# EasyEDA schematic SCH_SPEAR.json
TITLE: SPEAR; REV: 1.0; Date: 2022-12-17; Sheet: 1/1; Drawn By: Mirco H.; Company: None
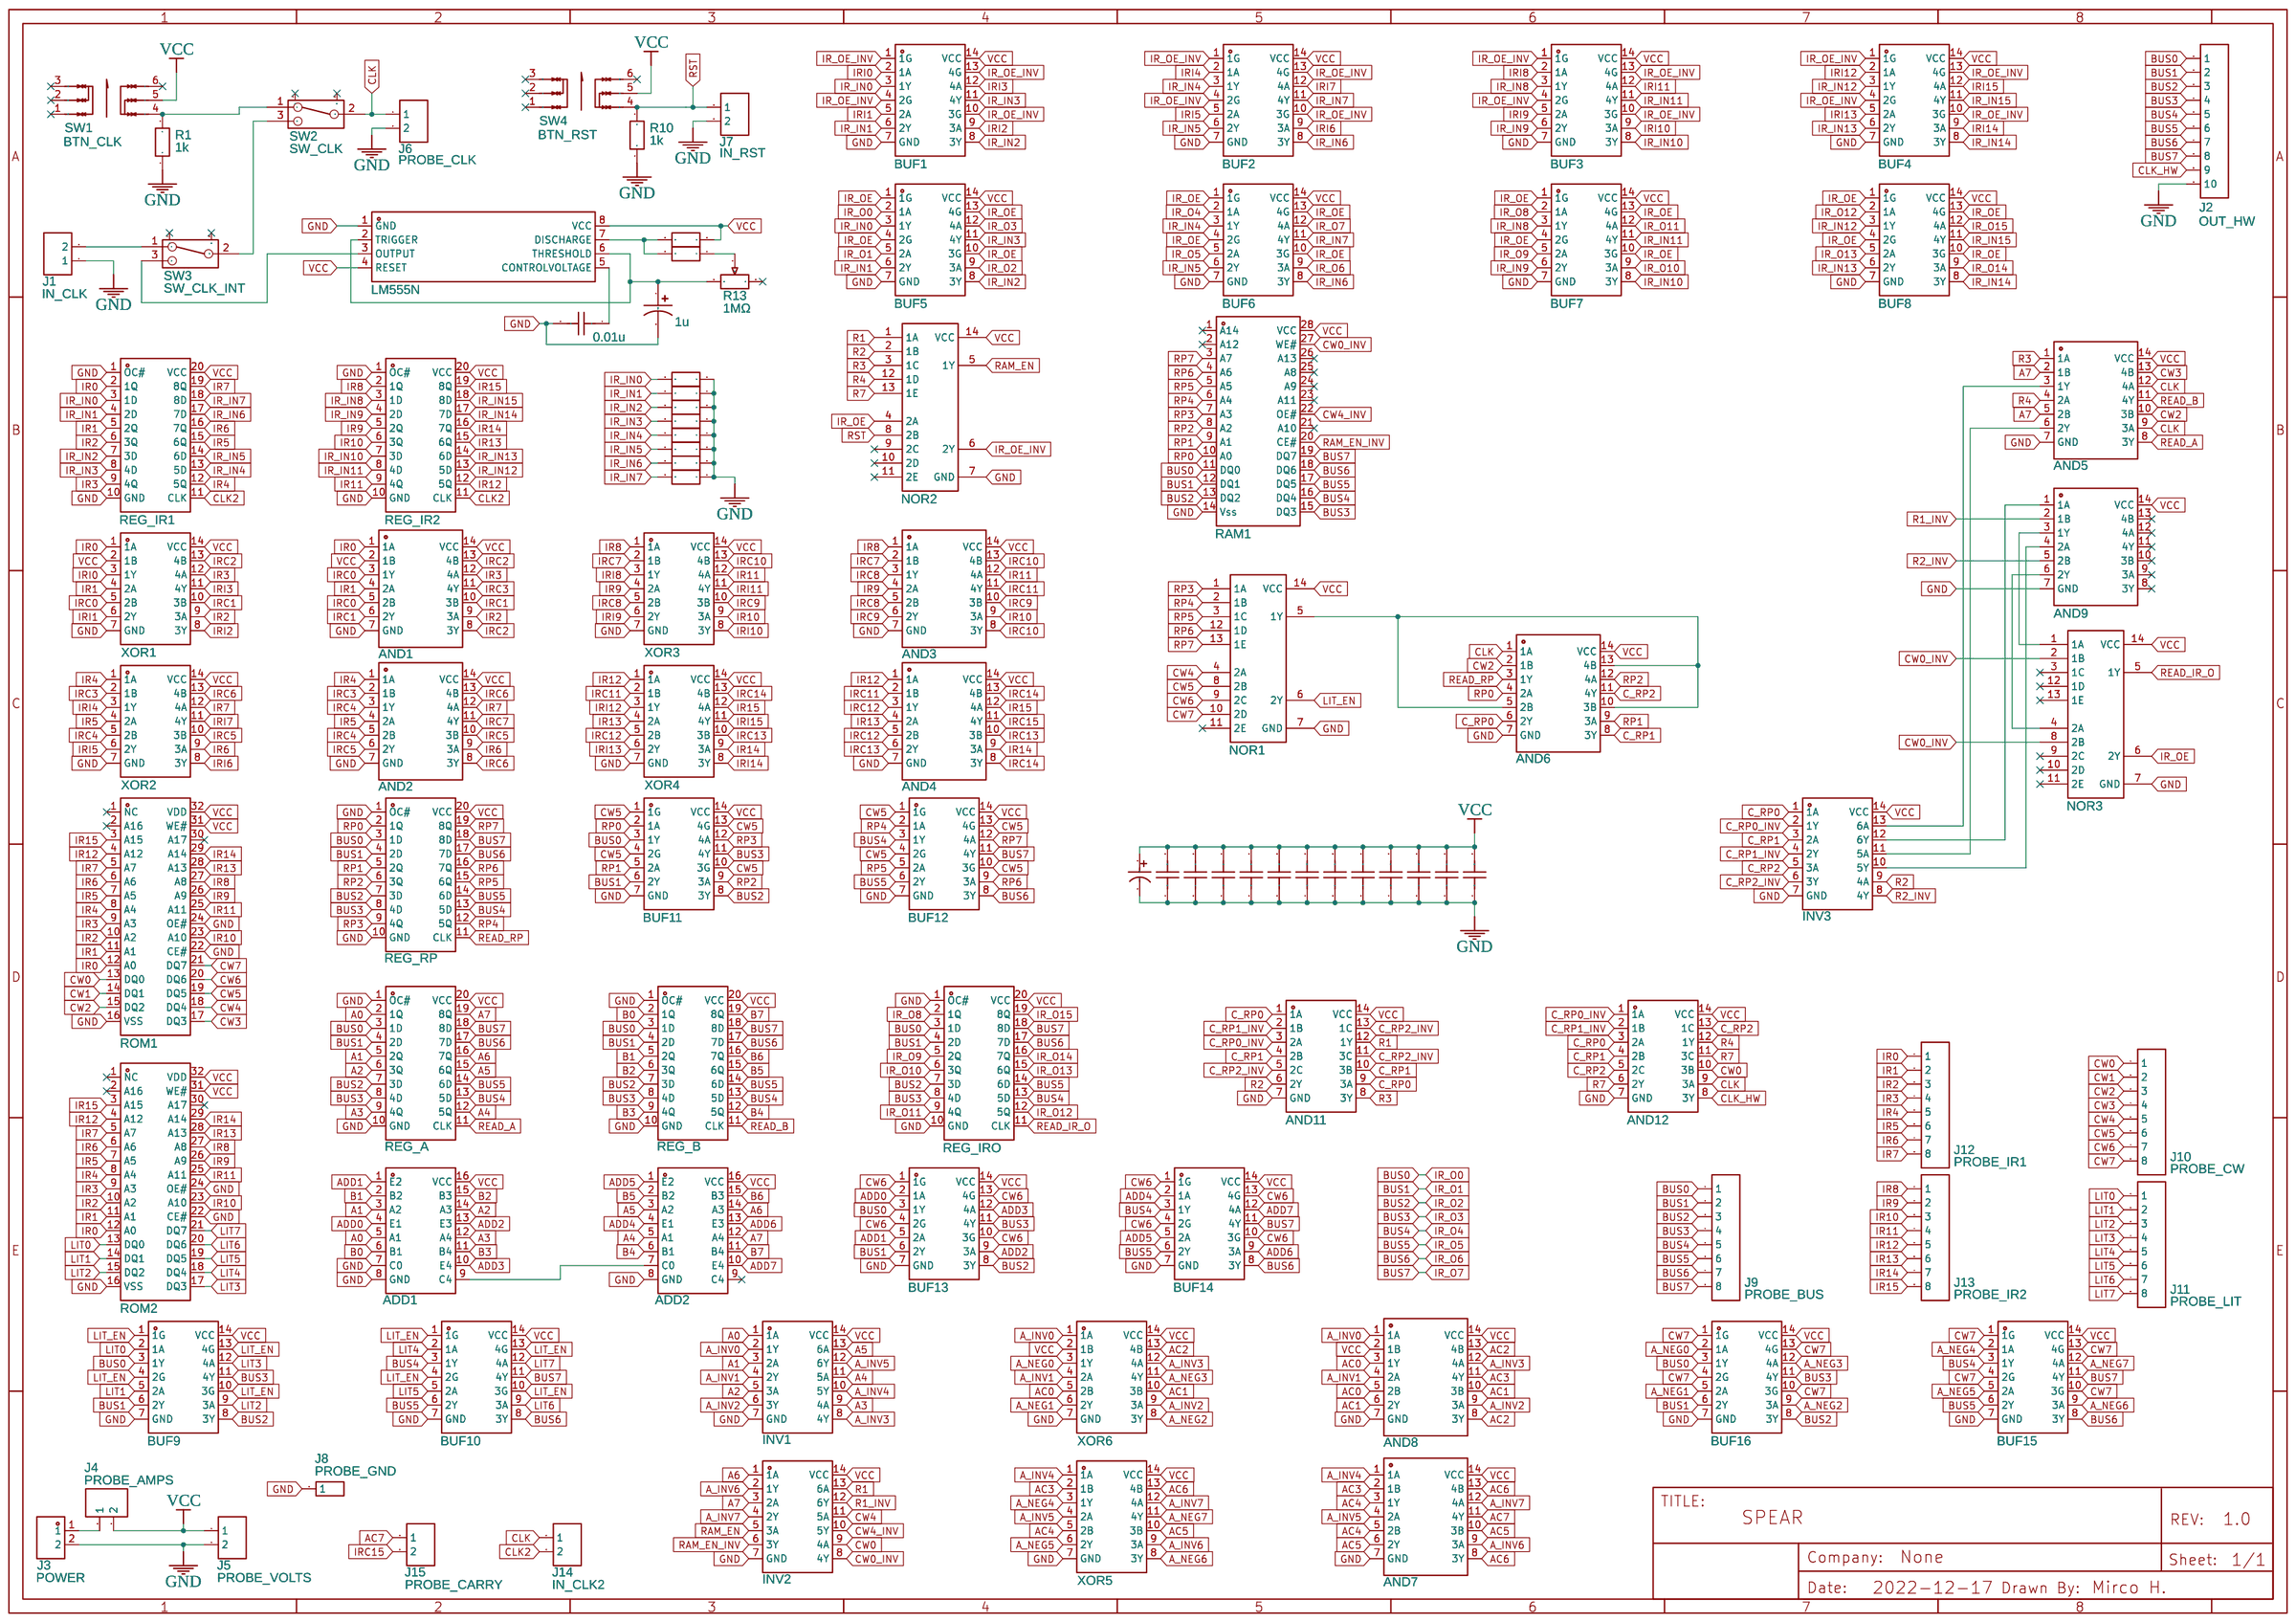
[diagram p0: schematic sheet]

## Parts
ADD1  XD74LS283  [DIP-16_L19.8-W6.5-P2.54-LS7.6-BL]
ADD2  XD74LS283  [DIP-16_L19.8-W6.5-P2.54-LS7.6-BL]
AND1  SN74LS08DR  [SOIC-14_L8.7-W3.9-P1.27-LS6.0-BL]
AND2  SN74LS08DR  [SOIC-14_L8.7-W3.9-P1.27-LS6.0-BL]
AND3  SN74LS08DR  [SOIC-14_L8.7-W3.9-P1.27-LS6.0-BL]
AND4  SN74LS08DR  [SOIC-14_L8.7-W3.9-P1.27-LS6.0-BL]
AND5  SN74LS08DR  [SOIC-14_L8.7-W3.9-P1.27-LS6.0-BL]
AND6  SN74LS08DR  [SOIC-14_L8.7-W3.9-P1.27-LS6.0-BL]
AND7  SN74LS08DR  [SOIC-14_L8.7-W3.9-P1.27-LS6.0-BL]
AND8  SN74LS08DR  [SOIC-14_L8.7-W3.9-P1.27-LS6.0-BL]
AND9  SN74LS08DR  [SOIC-14_L8.7-W3.9-P1.27-LS6.0-BL]
AND11  XL74LS11  [SOIC-14_L8.7-W3.9-P1.27-LS6.0-BL]
AND12  XL74LS11  [SOIC-14_L8.7-W3.9-P1.27-LS6.0-BL]
BUF1  SN74LS126ADR  [SOIC-14_L8.7-W3.9-P1.27-LS6.0-BL]
BUF2  SN74LS126ADR  [SOIC-14_L8.7-W3.9-P1.27-LS6.0-BL]
BUF3  SN74LS126ADR  [SOIC-14_L8.7-W3.9-P1.27-LS6.0-BL]
BUF4  SN74LS126ADR  [SOIC-14_L8.7-W3.9-P1.27-LS6.0-BL]
BUF5  SN74LS126ADR  [SOIC-14_L8.7-W3.9-P1.27-LS6.0-BL]
BUF6  SN74LS126ADR  [SOIC-14_L8.7-W3.9-P1.27-LS6.0-BL]
BUF7  SN74LS126ADR  [SOIC-14_L8.7-W3.9-P1.27-LS6.0-BL]
BUF8  SN74LS126ADR  [SOIC-14_L8.7-W3.9-P1.27-LS6.0-BL]
BUF9  SN74LS126ADR  [SOIC-14_L8.7-W3.9-P1.27-LS6.0-BL]
BUF10  SN74LS126ADR  [SOIC-14_L8.7-W3.9-P1.27-LS6.0-BL]
BUF11  SN74LS126ADR  [SOIC-14_L8.7-W3.9-P1.27-LS6.0-BL]
BUF12  SN74LS126ADR  [SOIC-14_L8.7-W3.9-P1.27-LS6.0-BL]
BUF13  SN74LS126ADR  [SOIC-14_L8.7-W3.9-P1.27-LS6.0-BL]
BUF14  SN74LS126ADR  [SOIC-14_L8.7-W3.9-P1.27-LS6.0-BL]
BUF15  SN74LS126ADR  [SOIC-14_L8.7-W3.9-P1.27-LS6.0-BL]
BUF16  SN74LS126ADR  [SOIC-14_L8.7-W3.9-P1.27-LS6.0-BL]
C1  0.1u  [C0603]
C2  0.01u  [C0603]
C3  1u  [CASE-A_3216]
C4  0.1u  [C0603]
C5  0.1u  [C0603]
C6  0.1u  [C0603]
C7  0.1u  [C0603]
C8  0.1u  [C0603]
C9  0.1u  [C0603]
C10  0.1u  [C0603]
C11  0.1u  [C0603]
C12  0.1u  [C0603]
C13  0.1u  [C0603]
C14  0.1u  [C0603]
C15  1000uF  [CAP-TH_BD10.0-P5.00-D1.0-FD]
INV1  XL74LS04  [SOP-14_L8.6-W3.9-P1.27-LS6.0-BL]
INV2  XL74LS04  [SOP-14_L8.6-W3.9-P1.27-LS6.0-BL]
INV3  XL74LS04  [SOP-14_L8.6-W3.9-P1.27-LS6.0-BL]
J1  IN_CLK  [HDR-M-2.54_1X2]
J2  OUT_HW  [HDR-M-2.54_1X10]
J3  POWER  [CONN-TH_2P-P5.00_L7.8-W10.0]
J4  PROBE_AMPS  [HDR-M-2.54_1X2]
J5  PROBE_VOLTS  [HDR-M-2.54_1X2]
J6  PROBE_CLK  [HDR-M-2.54_1X2]
J7  IN_RST  [HDR-M-2.54_1X2]
J8  PROBE_GND  [HDR-M-2.54_1X1]
J9  PROBE_BUS  [HDR-M-2.54_1X8]
J10  PROBE_CW  [HDR-M-2.54_1X8]
J11  PROBE_LIT  [HDR-M-2.54_1X8]
J12  PROBE_IR1  [HDR-M-2.54_1X8]
J13  PROBE_IR2  [HDR-M-2.54_1X8]
J14  IN_CLK2  [HDR-M-2.54_1X2]
J15  PROBE_CARRY  [HDR-M-2.54_1X2]
NOR1  LISA_CPU_74LS260  [LISA_DIP_14]
NOR2  LISA_CPU_74LS260  [LISA_DIP_14]
NOR3  LISA_CPU_74LS260  [LISA_DIP_14]
R1  1k  [R0603]
R2  10k  [R0603]
R3  10k  [R0603]
R4  10k  [R0603]
R5  10k  [R0603]
R6  10k  [R0603]
R7  10k  [R0603]
R8  10k  [R0603]
R9  10k  [R0603]
R10  1k  [R0603]
R11  1k  [R0603]
R12  1k  [R0603]
R13  1MΩ  [RES-ADJ-TH_3P-L7.1-W6.9-P2.50-L_3362P]
RAM1  LY62256SL-70LL  [PDIP-28_L37.0-W13.5-P2.54-LS15.6-BL]
REG1  REG_IR1  [SOIC-20_L13.3-W5.5-P1.27-LS7.8-BL]
REG2  REG_IR2  [SOIC-20_L13.3-W5.5-P1.27-LS7.8-BL]
REG_A  SN74LS374NSR  [SOIC-20_L13.3-W5.5-P1.27-LS7.8-BL]
REG_B  SN74LS374NSR  [SOIC-20_L13.3-W5.5-P1.27-LS7.8-BL]
REG_IRO  SN74LS374NSR  [SOIC-20_L13.3-W5.5-P1.27-LS7.8-BL]
REG_RP  SN74LS374NSR  [SOIC-20_L13.3-W5.5-P1.27-LS7.8-BL]
ROM1  SST39SF020A-70-4I-NHE  [PDIP-32_L41.7-W13.3-P2.54-LS15.2-BL]
ROM2  SST39SF020A-70-4I-NHE  [PDIP-32_L41.7-W13.3-P2.54-LS15.2-BL]
SW1  BTN_CLK  [SW-TH_6P-L8.0-W8.0-P2.50]
SW2  SW_CLK  [SW-TH_SK-12E12-G5]
SW3  SW_CLK_INT  [SW-TH_SK-12E12-G5]
SW4  BTN_RST  [SW-TH_6P-L8.0-W8.0-P2.50]
U1  LM555N  [DIP-8_L9.7-W6.4-P2.54-LS7.6-BL]
XOR1  XD74LS86  [DIP-14_L20.0-W7.6-P2.54-LS7.6-BL]
XOR2  XD74LS86  [DIP-14_L20.0-W7.6-P2.54-LS7.6-BL]
XOR3  XD74LS86  [DIP-14_L20.0-W7.6-P2.54-LS7.6-BL]
XOR4  XD74LS86  [DIP-14_L20.0-W7.6-P2.54-LS7.6-BL]
XOR5  XD74LS86  [DIP-14_L20.0-W7.6-P2.54-LS7.6-BL]
XOR6  XD74LS86  [DIP-14_L20.0-W7.6-P2.54-LS7.6-BL]

## Library data of the parts
ADD1 ADD2 = XD74LS283: Supplier: LCSC; Supplier Part: C561301; Manufacturer: XINLUDA(信路达); Contributor: LCSC; JLCPCB Part Class: Extended Part
AND1-AND9 = SN74LS08DR: Supplier: LCSC; Manufacturer: TI(德州仪器); Supplier Part: C6802; JLCPCB Part Class: Extended Part
AND11 AND12 = XL74LS11: Supplier: LCSC; Supplier Part: C521168; Manufacturer: XINLUDA(信路达); Contributor: LCSC; JLCPCB Part Class: Extended Part
BUF1-BUF16 = SN74LS126ADR: Supplier: LCSC; Supplier Part: C2865257; Manufacturer: TI(德州仪器); link: https://atta.szlcsc.comnull; Contributor: LCSC
C1 C2 C4-C14 = C_0603_US: Contributor: LCEDA_Lib
C3 = C_Tan_SMD_A_US: Contributor: LCEDA_Lib
C15 = 1000uF 25V: Supplier: LCSC; Manufacturer: CX(承兴); Manufacturer Part: KM108M025G17RR0VH2FP0; Supplier Part: C10750; JLCPCB Part Class: Extended Part
INV1-INV3 = XL74LS04: Supplier: LCSC; Supplier Part: C513511; Manufacturer: XINLUDA(信路达); Contributor: LCSC; JLCPCB Part Class: Extended Part
J1 J4-J7 J14 J15 = HDR-M-2.54_1x2: Supplier Part: C124375; Supplier: LCSC; Contributor: LCEDA_Lib
J2 = HDR-M-2.54_1x10: Supplier Part: C57369; Supplier: LCSC; Contributor: LCEDA_Lib
J3 = DB126V-5.0-2P: Supplier: LCSC; Supplier Part: C395849; Manufacturer: DIBO(地博电气); Manufacturer Part: DB126V-5.0-2P-GN-P; Contributor: LCSC; JLCPCB Part Class: Extended Part
J8 = HDR-M-2.54_1x1: Supplier Part: C81276; Supplier: LCSC; Contributor: LCEDA_Lib
J9-J13 = HDR-M-2.54_1x8: Supplier Part: C190820; Supplier: LCSC; Contributor: LCEDA_Lib
NOR1-NOR3 = LISA_CPU_74LS260: Contributor: William Tooker
R1-R12 = R_0603_EU: Contributor: LCEDA_Lib
R13 = 3362P-1-105_C118945: Supplier: LCSC; Supplier Part: C118945; Manufacturer: BOCHEN(博晨); Manufacturer Part: 3362P-1-105; Resistance(Ohms): 1M; Contributor: LCSC; Resistance (Ohms): 1M; JLCPCB Part Class: Extended Part
RAM1 = LY62256SL-70LL: Supplier: LCSC; Supplier Part: C261867; Manufacturer: Lyontek Inc.; Contributor: LCSC
REG1 REG2 REG_A REG_B REG_IRO REG_RP = SN74LS374NSR: Supplier: LCSC; Manufacturer: TI(德州仪器); Supplier Part: C7764; JLCPCB Part Class: Extended Part
ROM1 ROM2 = SST39SF020A-70-4I-NHE: Supplier: LCSC; Supplier Part: C645934; Manufacturer: MICROCHIP(美国微芯); link: https://atta.szlcsc.comnull; Contributor: lcsc; JLCPCB Part Class: Extended Part
SW1 SW4 = XKB8080-W: Supplier: LCSC; Supplier Part: C318861; Manufacturer: XKB Enterprise; Contributor: LCSC; JLCPCB Part Class: Extended Part
SW2 SW3 = SK-12E12-G5: Supplier: LCSC; Supplier Part: C136720; Manufacturer: 韩国韩荣; Contributor: LCSC; JLCPCB Part Class: Extended Part
U1 = LM555N: Supplier: LCSC; Supplier Part: C725327; Manufacturer: HGSEMI(华冠); Contributor: LCSC; JLCPCB Part Class: Extended Part
XOR1-XOR6 = XD74LS86: Supplier: LCSC; Supplier Part: C556290; Manufacturer: XINLUDA; Contributor: LCSC; JLCPCB Part Class: Extended Part

## Nets
GND: ADD1.7(C0) ADD1.8(GND) ADD2.8(GND) AND1.7(GND) AND2.7(GND) AND3.7(GND) AND4.7(GND) AND5.7(GND) AND6.7(GND) AND7.7(GND) AND8.7(GND) AND9.7(GND) AND11.7(GND) AND12.7(GND) BUF1.7(GND) BUF2.7(GND) BUF3.7(GND) BUF4.7(GND) BUF5.7(GND) BUF6.7(GND) BUF7.7(GND) BUF8.7(GND) BUF9.7(GND) BUF10.7(GND) BUF11.7(GND) BUF12.7(GND) BUF13.7(GND) BUF14.7(GND) BUF15.7(GND) BUF16.7(GND) C1.1 C2.2 C3.2 C4.1 C5.1 C6.1 C7.1 C8.1 C9.1 C10.1 C11.1 C12.1 C13.1 C14.1 C15.2 INV1.7(GND) INV2.7(GND) INV3.7(GND) J1.1 J2.10 J3.2 J5.2 J6.2 J7.2 J8.1 NOR1.7(GND) NOR2.7(GND) NOR3.7(GND) R1.1 R2.1 R3.1 R4.1 R5.1 R6.1 R7.1 R8.1 R9.1 R10.1 RAM1.14(Vss) REG1.1(OC#) REG1.10(GND) REG2.1(OC#) REG2.10(GND) REG_A.1(OC#) REG_A.10(GND) REG_B.1(OC#) REG_B.10(GND) REG_IRO.1(OC#) REG_IRO.10(GND) REG_RP.1(OC#) REG_RP.10(GND) ROM1.16(VSS) ROM1.22(CE#) ROM1.24(OE#) ROM2.16(VSS) ROM2.22(CE#) ROM2.24(OE#) U1.1(GND) XOR1.7(GND) XOR2.7(GND) XOR3.7(GND) XOR4.7(GND) XOR5.7(GND) XOR6.7(GND)
VCC: ADD1.16(VCC) ADD2.16(VCC) AND1.2(1B) AND1.14(VCC) AND2.14(VCC) AND3.14(VCC) AND4.14(VCC) AND5.14(VCC) AND6.14(VCC) AND7.14(VCC) AND8.2(1B) AND8.14(VCC) AND9.14(VCC) AND11.14(VCC) AND12.14(VCC) BUF1.14(VCC) BUF2.14(VCC) BUF3.14(VCC) BUF4.14(VCC) BUF5.14(VCC) BUF6.14(VCC) BUF7.14(VCC) BUF8.14(VCC) BUF9.14(VCC) BUF10.14(VCC) BUF11.14(VCC) BUF12.14(VCC) BUF13.14(VCC) BUF14.14(VCC) BUF15.14(VCC) BUF16.14(VCC) C1.2 C4.2 C5.2 C6.2 C7.2 C8.2 C9.2 C10.2 C11.2 C12.2 C13.2 C14.2 C15.1 INV1.14(VCC) INV2.14(VCC) INV3.14(VCC) J4.2 J5.1 NOR1.14(VCC) NOR2.14(VCC) NOR3.14(VCC) R11.1 RAM1.28(VCC) REG1.20(VCC) REG2.20(VCC) REG_A.20(VCC) REG_B.20(VCC) REG_IRO.20(VCC) REG_RP.20(VCC) ROM1.31(WE#) ROM1.32(VDD) ROM2.31(WE#) ROM2.32(VDD) SW1.5 SW4.5 U1.4(RESET) U1.8(VCC) XOR1.2(1B) XOR1.14(VCC) XOR2.14(VCC) XOR3.14(VCC) XOR4.14(VCC) XOR5.14(VCC) XOR6.2(1B) XOR6.14(VCC)
A0: ADD1.5(A1) INV1.1(1A) REG_A.2(1Q)
A1: ADD1.3(A2) INV1.3(2A) REG_A.5(2Q)
A2: ADD1.14(A3) INV1.5(3A) REG_A.6(3Q)
A3: ADD1.12(A4) INV1.9(4A) REG_A.9(4Q)
A4: ADD2.5(A1) INV1.11(5A) REG_A.12(5Q)
A5: ADD2.3(A2) INV1.13(6A) REG_A.15(6Q)
A6: ADD2.14(A3) INV2.1(1A) REG_A.16(7Q)
A7: ADD2.12(A4) AND5.2(1B) AND5.5(2B) INV2.3(2A) REG_A.19(8Q)
A_INV0: AND8.1(1A) INV1.2(1Y) XOR6.1(1A)
A_INV1: AND8.4(2A) INV1.4(2Y) XOR6.4(2A)
A_INV2: AND8.9(3A) INV1.6(3Y) XOR6.9(3A)
A_INV3: AND8.12(4A) INV1.8(4Y) XOR6.12(4A)
A_INV4: AND7.1(1A) INV1.10(5Y) XOR5.1(1A)
A_INV5: AND7.4(2A) INV1.12(6Y) XOR5.4(2A)
A_INV6: AND7.9(3A) INV2.2(1Y) XOR5.9(3A)
A_INV7: AND7.12(4A) INV2.4(2Y) XOR5.12(4A)
A_NEG0: BUF16.2(1A) XOR6.3(1Y)
A_NEG1: BUF16.5(2A) XOR6.6(2Y)
A_NEG2: BUF16.9(3A) XOR6.8(3Y)
A_NEG3: BUF16.12(4A) XOR6.11(4Y)
A_NEG4: BUF15.2(1A) XOR5.3(1Y)
A_NEG5: BUF15.5(2A) XOR5.6(2Y)
A_NEG6: BUF15.9(3A) XOR5.8(3Y)
A_NEG7: BUF15.12(4A) XOR5.11(4Y)
AC0: AND8.3(1Y) AND8.5(2B) XOR6.5(2B)
AC1: AND8.6(2Y) AND8.10(3B) XOR6.10(3B)
AC2: AND8.8(3Y) AND8.13(4B) XOR6.13(4B)
AC3: AND7.2(1B) AND8.11(4Y) XOR5.2(1B)
AC4: AND7.3(1Y) AND7.5(2B) XOR5.5(2B)
AC5: AND7.6(2Y) AND7.10(3B) XOR5.10(3B)
AC6: AND7.8(3Y) AND7.13(4B) XOR5.13(4B)
AC7: AND7.11(4Y) J15.1
ADD0: ADD1.4(E1) BUF13.2(1A)
ADD1: ADD1.1(E2) BUF13.5(2A)
ADD2: ADD1.13(E3) BUF13.9(3A)
ADD3: ADD1.10(E4) BUF13.12(4A)
ADD4: ADD2.4(E1) BUF14.2(1A)
ADD5: ADD2.1(E2) BUF14.5(2A)
ADD6: ADD2.13(E3) BUF14.9(3A)
ADD7: ADD2.10(E4) BUF14.12(4A)
B0: ADD1.6(B1) REG_B.2(1Q)
B1: ADD1.2(B2) REG_B.5(2Q)
B2: ADD1.15(B3) REG_B.6(3Q)
B3: ADD1.11(B4) REG_B.9(4Q)
B4: ADD2.6(B1) REG_B.12(5Q)
B5: ADD2.2(B2) REG_B.15(6Q)
B6: ADD2.15(B3) REG_B.16(7Q)
B7: ADD2.11(B4) REG_B.19(8Q)
BUS0: BUF5.2(1A) BUF9.3(1Y) BUF11.3(1Y) BUF13.3(1Y) BUF16.3(1Y) J2.1 J9.1 RAM1.11(DQ0) REG_A.3(1D) REG_B.3(1D) REG_IRO.3(1D) REG_RP.3(1D)
BUS1: BUF5.5(2A) BUF9.6(2Y) BUF11.6(2Y) BUF13.6(2Y) BUF16.6(2Y) J2.2 J9.2 RAM1.12(DQ1) REG_A.4(2D) REG_B.4(2D) REG_IRO.4(2D) REG_RP.4(2D)
BUS2: BUF5.9(3A) BUF9.8(3Y) BUF11.8(3Y) BUF13.8(3Y) BUF16.8(3Y) J2.3 J9.3 RAM1.13(DQ2) REG_A.7(3D) REG_B.7(3D) REG_IRO.7(3D) REG_RP.7(3D)
BUS3: BUF5.12(4A) BUF9.11(4Y) BUF11.11(4Y) BUF13.11(4Y) BUF16.11(4Y) J2.4 J9.4 RAM1.15(DQ3) REG_A.8(4D) REG_B.8(4D) REG_IRO.8(4D) REG_RP.8(4D)
BUS4: BUF6.2(1A) BUF10.3(1Y) BUF12.3(1Y) BUF14.3(1Y) BUF15.3(1Y) J2.5 J9.5 RAM1.16(DQ4) REG_A.13(5D) REG_B.13(5D) REG_IRO.13(5D) REG_RP.13(5D)
BUS5: BUF6.5(2A) BUF10.6(2Y) BUF12.6(2Y) BUF14.6(2Y) BUF15.6(2Y) J2.6 J9.6 RAM1.17(DQ5) REG_A.14(6D) REG_B.14(6D) REG_IRO.14(6D) REG_RP.14(6D)
BUS6: BUF6.9(3A) BUF10.8(3Y) BUF12.8(3Y) BUF14.8(3Y) BUF15.8(3Y) J2.7 J9.7 RAM1.18(DQ6) REG_A.17(7D) REG_B.17(7D) REG_IRO.17(7D) REG_RP.17(7D)
BUS7: BUF6.12(4A) BUF10.11(4Y) BUF12.11(4Y) BUF14.11(4Y) BUF15.11(4Y) J2.8 J9.8 RAM1.19(DQ7) REG_A.18(8D) REG_B.18(8D) REG_IRO.18(8D) REG_RP.18(8D)
C_RP0: AND6.6(2Y) AND11.1(1A) AND11.9(3A) AND12.3(2A) INV3.1(1A)
C_RP0_INV: AND11.3(2A) AND12.1(1A) INV3.2(1Y)
C_RP1: AND6.8(3Y) AND11.4(2B) AND11.10(3B) AND12.4(2B) INV3.3(2A)
C_RP1_INV: AND11.2(1B) AND12.2(1B) INV3.4(2Y)
C_RP2: AND6.11(4Y) AND12.5(2C) AND12.13(1C) INV3.5(3A)
C_RP2_INV: AND11.5(2C) AND11.11(3C) AND11.13(1C) INV3.6(3Y)
CLK: AND5.9(3A) AND5.12(4A) AND6.1(1A) AND12.9(3A) J6.1 J14.1 SW2.2
CLK2: J14.2 REG1.11(CLK) REG2.11(CLK)
CLK_HW: AND12.8(3Y) J2.9
CW0: AND12.10(3B) INV2.9(4A) J10.1 ROM1.13(DQ0)
CW0_INV: INV2.8(4Y) NOR3.2(1B) NOR3.8(2B) RAM1.27(WE#)
CW1: J10.2 ROM1.14(DQ1)
CW2: AND5.10(3B) AND6.2(1B) J10.3 ROM1.15(DQ2)
CW3: AND5.13(4B) J10.4 ROM1.17(DQ3)
CW4: INV2.11(5A) J10.5 NOR1.4(2A) ROM1.18(DQ4)
CW4_INV: INV2.10(5Y) RAM1.22(OE#)
CW5: BUF11.1(1G) BUF11.4(2G) BUF11.10(3G) BUF11.13(4G) BUF12.1(1G) BUF12.4(2G) BUF12.10(3G) BUF12.13(4G) J10.6 NOR1.8(2B) ROM1.19(DQ5)
CW6: BUF13.1(1G) BUF13.4(2G) BUF13.10(3G) BUF13.13(4G) BUF14.1(1G) BUF14.4(2G) BUF14.10(3G) BUF14.13(4G) J10.7 NOR1.9(2C) ROM1.20(DQ6)
CW7: BUF15.1(1G) BUF15.4(2G) BUF15.10(3G) BUF15.13(4G) BUF16.1(1G) BUF16.4(2G) BUF16.10(3G) BUF16.13(4G) J10.8 NOR1.10(2D) ROM1.21(DQ7)
IR0: AND1.1(1A) J12.1 REG1.2(1Q) ROM1.12(A0) ROM2.12(A0) XOR1.1(1A)
IR1: AND1.4(2A) J12.2 REG1.5(2Q) ROM1.11(A1) ROM2.11(A1) XOR1.4(2A)
IR2: AND1.9(3A) J12.3 REG1.6(3Q) ROM1.10(A2) ROM2.10(A2) XOR1.9(3A)
IR3: AND1.12(4A) J12.4 REG1.9(4Q) ROM1.9(A3) ROM2.9(A3) XOR1.12(4A)
IR4: AND2.1(1A) J12.5 REG1.12(5Q) ROM1.8(A4) ROM2.8(A4) XOR2.1(1A)
IR5: AND2.4(2A) J12.6 REG1.15(6Q) ROM1.7(A5) ROM2.7(A5) XOR2.4(2A)
IR6: AND2.9(3A) J12.7 REG1.16(7Q) ROM1.6(A6) ROM2.6(A6) XOR2.9(3A)
IR7: AND2.12(4A) J12.8 REG1.19(8Q) ROM1.5(A7) ROM2.5(A7) XOR2.12(4A)
IR8: AND3.1(1A) J13.1 REG2.2(1Q) ROM1.27(A8) ROM2.27(A8) XOR3.1(1A)
IR9: AND3.4(2A) J13.2 REG2.5(2Q) ROM1.26(A9) ROM2.26(A9) XOR3.4(2A)
IR10: AND3.9(3A) J13.3 REG2.6(3Q) ROM1.23(A10) ROM2.23(A10) XOR3.9(3A)
IR11: AND3.12(4A) J13.4 REG2.9(4Q) ROM1.25(A11) ROM2.25(A11) XOR3.12(4A)
IR12: AND4.1(1A) J13.5 REG2.12(5Q) ROM1.4(A12) ROM2.4(A12) XOR4.1(1A)
IR13: AND4.4(2A) J13.6 REG2.15(6Q) ROM1.28(A13) ROM2.28(A13) XOR4.4(2A)
IR14: AND4.9(3A) J13.7 REG2.16(7Q) ROM1.29(A14) ROM2.29(A14) XOR4.9(3A)
IR15: AND4.12(4A) J13.8 REG2.19(8Q) ROM1.3(A15) ROM2.3(A15) XOR4.12(4A)
IR_IN0: BUF1.3(1Y) BUF5.3(1Y) R2.2 REG1.3(1D)
IR_IN1: BUF1.6(2Y) BUF5.6(2Y) R3.2 REG1.4(2D)
IR_IN2: BUF1.8(3Y) BUF5.8(3Y) R4.2 REG1.7(3D)
IR_IN3: BUF1.11(4Y) BUF5.11(4Y) R5.2 REG1.8(4D)
IR_IN4: BUF2.3(1Y) BUF6.3(1Y) R6.2 REG1.13(5D)
IR_IN5: BUF2.6(2Y) BUF6.6(2Y) R7.2 REG1.14(6D)
IR_IN6: BUF2.8(3Y) BUF6.8(3Y) R8.2 REG1.17(7D)
IR_IN7: BUF2.11(4Y) BUF6.11(4Y) R9.2 REG1.18(8D)
IR_IN8: BUF3.3(1Y) BUF7.3(1Y) REG2.3(1D)
IR_IN9: BUF3.6(2Y) BUF7.6(2Y) REG2.4(2D)
IR_IN10: BUF3.8(3Y) BUF7.8(3Y) REG2.7(3D)
IR_IN11: BUF3.11(4Y) BUF7.11(4Y) REG2.8(4D)
IR_IN12: BUF4.3(1Y) BUF8.3(1Y) REG2.13(5D)
IR_IN13: BUF4.6(2Y) BUF8.6(2Y) REG2.14(6D)
IR_IN14: BUF4.8(3Y) BUF8.8(3Y) REG2.17(7D)
IR_IN15: BUF4.11(4Y) BUF8.11(4Y) REG2.18(8D)
IR_O8: BUF7.2(1A) REG_IRO.2(1Q)
IR_O9: BUF7.5(2A) REG_IRO.5(2Q)
IR_O10: BUF7.9(3A) REG_IRO.6(3Q)
IR_O11: BUF7.12(4A) REG_IRO.9(4Q)
IR_O12: BUF8.2(1A) REG_IRO.12(5Q)
IR_O13: BUF8.5(2A) REG_IRO.15(6Q)
IR_O14: BUF8.9(3A) REG_IRO.16(7Q)
IR_O15: BUF8.12(4A) REG_IRO.19(8Q)
IR_OE: BUF5.1(1G) BUF5.4(2G) BUF5.10(3G) BUF5.13(4G) BUF6.1(1G) BUF6.4(2G) BUF6.10(3G) BUF6.13(4G) BUF7.1(1G) BUF7.4(2G) BUF7.10(3G) BUF7.13(4G) BUF8.1(1G) BUF8.4(2G) BUF8.10(3G) BUF8.13(4G) NOR2.4(2A) NOR3.6(2Y)
IR_OE_INV: BUF1.1(1G) BUF1.4(2G) BUF1.10(3G) BUF1.13(4G) BUF2.1(1G) BUF2.4(2G) BUF2.10(3G) BUF2.13(4G) BUF3.1(1G) BUF3.4(2G) BUF3.10(3G) BUF3.13(4G) BUF4.1(1G) BUF4.4(2G) BUF4.10(3G) BUF4.13(4G) NOR2.6(2Y)
IRC0: AND1.3(1Y) AND1.5(2B) XOR1.5(2B)
IRC1: AND1.6(2Y) AND1.10(3B) XOR1.10(3B)
IRC2: AND1.8(3Y) AND1.13(4B) XOR1.13(4B)
IRC3: AND1.11(4Y) AND2.2(1B) XOR2.2(1B)
IRC4: AND2.3(1Y) AND2.5(2B) XOR2.5(2B)
IRC5: AND2.6(2Y) AND2.10(3B) XOR2.10(3B)
IRC6: AND2.8(3Y) AND2.13(4B) XOR2.13(4B)
IRC7: AND2.11(4Y) AND3.2(1B) XOR3.2(1B)
IRC8: AND3.3(1Y) AND3.5(2B) XOR3.5(2B)
IRC9: AND3.6(2Y) AND3.10(3B) XOR3.10(3B)
IRC10: AND3.8(3Y) AND3.13(4B) XOR3.13(4B)
IRC11: AND3.11(4Y) AND4.2(1B) XOR4.2(1B)
IRC12: AND4.3(1Y) AND4.5(2B) XOR4.5(2B)
IRC13: AND4.6(2Y) AND4.10(3B) XOR4.10(3B)
IRC14: AND4.8(3Y) AND4.13(4B) XOR4.13(4B)
IRC15: AND4.11(4Y) J15.2
IRI0: BUF1.2(1A) XOR1.3(1Y)
IRI1: BUF1.5(2A) XOR1.6(2Y)
IRI2: BUF1.9(3A) XOR1.8(3Y)
IRI3: BUF1.12(4A) XOR1.11(4Y)
IRI4: BUF2.2(1A) XOR2.3(1Y)
IRI5: BUF2.5(2A) XOR2.6(2Y)
IRI6: BUF2.9(3A) XOR2.8(3Y)
IRI7: BUF2.12(4A) XOR2.11(4Y)
IRI8: BUF3.2(1A) XOR3.3(1Y)
IRI9: BUF3.5(2A) XOR3.6(2Y)
IRI10: BUF3.9(3A) XOR3.8(3Y)
IRI11: BUF3.12(4A) XOR3.11(4Y)
IRI12: BUF4.2(1A) XOR4.3(1Y)
IRI13: BUF4.5(2A) XOR4.6(2Y)
IRI14: BUF4.9(3A) XOR4.8(3Y)
IRI15: BUF4.12(4A) XOR4.11(4Y)
LIT0: BUF9.2(1A) J11.1 ROM2.13(DQ0)
LIT1: BUF9.5(2A) J11.2 ROM2.14(DQ1)
LIT2: BUF9.9(3A) J11.3 ROM2.15(DQ2)
LIT3: BUF9.12(4A) J11.4 ROM2.17(DQ3)
LIT4: BUF10.2(1A) J11.5 ROM2.18(DQ4)
LIT5: BUF10.5(2A) J11.6 ROM2.19(DQ5)
LIT6: BUF10.9(3A) J11.7 ROM2.20(DQ6)
LIT7: BUF10.12(4A) J11.8 ROM2.21(DQ7)
LIT_EN: BUF9.1(1G) BUF9.4(2G) BUF9.10(3G) BUF9.13(4G) BUF10.1(1G) BUF10.4(2G) BUF10.10(3G) BUF10.13(4G) NOR1.6(2Y)
R1: AND11.12(1Y) INV2.13(6A) NOR2.1(1A)
R1_INV: AND9.2(1B) INV2.12(6Y)
R2: AND11.6(2Y) INV3.9(4A) NOR2.2(1B)
R2_INV: AND9.5(2B) INV3.8(4Y)
R3: AND5.1(1A) AND11.8(3Y) NOR2.3(1C)
R4: AND5.4(2A) AND12.12(1Y) NOR2.12(1D)
R7: AND12.6(2Y) AND12.11(3C) NOR2.13(1E)
RAM_EN: INV2.5(3A) NOR2.5(1Y)
RAM_EN_INV: INV2.6(3Y) RAM1.20(CE#)
READ_A: AND5.8(3Y) REG_A.11(CLK)
READ_B: AND5.11(4Y) REG_B.11(CLK)
READ_IR_O: NOR3.5(1Y) REG_IRO.11(CLK)
READ_RP: AND6.3(1Y) REG_RP.11(CLK)
RP0: AND6.4(2A) BUF11.2(1A) RAM1.10(A0) REG_RP.2(1Q)
RP1: AND6.9(3A) BUF11.5(2A) RAM1.9(A1) REG_RP.5(2Q)
RP2: AND6.12(4A) BUF11.9(3A) RAM1.8(A2) REG_RP.6(3Q)
RP3: BUF11.12(4A) NOR1.1(1A) RAM1.7(A3) REG_RP.9(4Q)
RP4: BUF12.2(1A) NOR1.2(1B) RAM1.6(A4) REG_RP.12(5Q)
RP5: BUF12.5(2A) NOR1.3(1C) RAM1.5(A5) REG_RP.15(6Q)
RP6: BUF12.9(3A) NOR1.12(1D) RAM1.4(A6) REG_RP.16(7Q)
RP7: BUF12.12(4A) NOR1.13(1E) RAM1.3(A7) REG_RP.19(8Q)
RST: J7.1 NOR2.8(2B) R10.2 SW4.4
Net-(ADD1-9): ADD1.9(C4) ADD2.7(C0)
Net-(AND5-3): AND5.3(1Y) INV3.13(6A)
Net-(AND5-6): AND5.6(2Y) INV3.11(5A)
Net-(AND6-5): AND6.5(2B) AND6.10(3B) AND6.13(4B) NOR1.5(1Y)
Net-(AND9-1): AND9.1(1A) INV3.12(6Y)
Net-(AND9-3): AND9.3(1Y) NOR3.1(1A)
Net-(AND9-4): AND9.4(2A) INV3.10(5Y)
Net-(AND9-6): AND9.6(2Y) NOR3.4(2A)
Net-(C2-1): C2.1 U1.5(CONTROLVOLTAGE)
Net-(C3-1): C3.1 R13.1 U1.2(TRIGGER) U1.6(THRESHOLD)
Net-(J1-2): J1.2 SW3.1
Net-(J3-1): J3.1 J4.1
Net-(R1-2): R1.2 SW1.4 SW2.1
Net-(R11-2): R11.2 R12.2 U1.7(DISCHARGE)
Net-(R12-1): R12.1 R13.2
Net-(SW2-3): SW2.3 SW3.2
Net-(SW3-3): SW3.3 U1.3(OUTPUT)

Not connected (* = marked no-connect by the designer): ADD2 9(C4)*; AND9 8(3Y)* 9(3A)* 10(3B)* 11(4Y)* 12(4A)* 13(4B)*; NOR1 11(2E)*; NOR2 9(2C)* 10(2D)* 11(2E)*; NOR3 3(1C)* 9(2C)* 10(2D)* 11(2E)* 12(1D)* 13(1E)*; R13 3*; RAM1 1(A14)* 2(A12)* 21(A10)* 23(A11)* 24(A9)* 25(A8)* 26(A13)*; ROM1 1(NC)* 2(A16)* 30(A17)*; ROM2 1(NC)* 2(A16)* 30(A17)*; SW1 1* 2* 3* 6*; SW2 4* 5*; SW3 4* 5*; SW4 1* 2* 3* 6*
